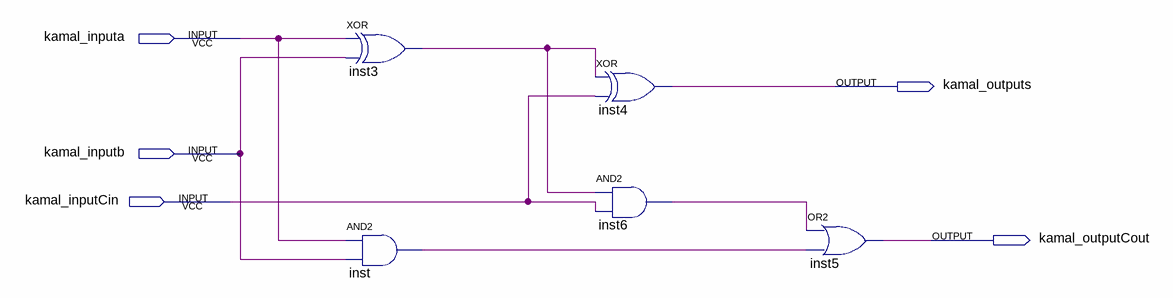
[diagram p0: schematic sheet]
// Quartus schematic kamal_lab1fulladder.bdf as structural Verilog: 5 symbols, 5 pins
module kamal_lab1fulladder (
  input  kamal_inputa,
  input  kamal_inputb,
  input  kamal_inputCin,
  output kamal_outputs,
  output kamal_outputCout
);

  wire inst3_out, inst6_out, inst_out;

  xor inst3 (inst3_out, kamal_inputa, kamal_inputb);
  and inst (inst_out, kamal_inputa, kamal_inputb);
  xor inst4 (kamal_outputs, inst3_out, kamal_inputCin);
  and inst6 (inst6_out, inst3_out, kamal_inputCin);
  or inst5 (kamal_outputCout, inst6_out, inst_out);
endmodule
